# Altium schematic sheet Sheet1.SchDoc
size A3
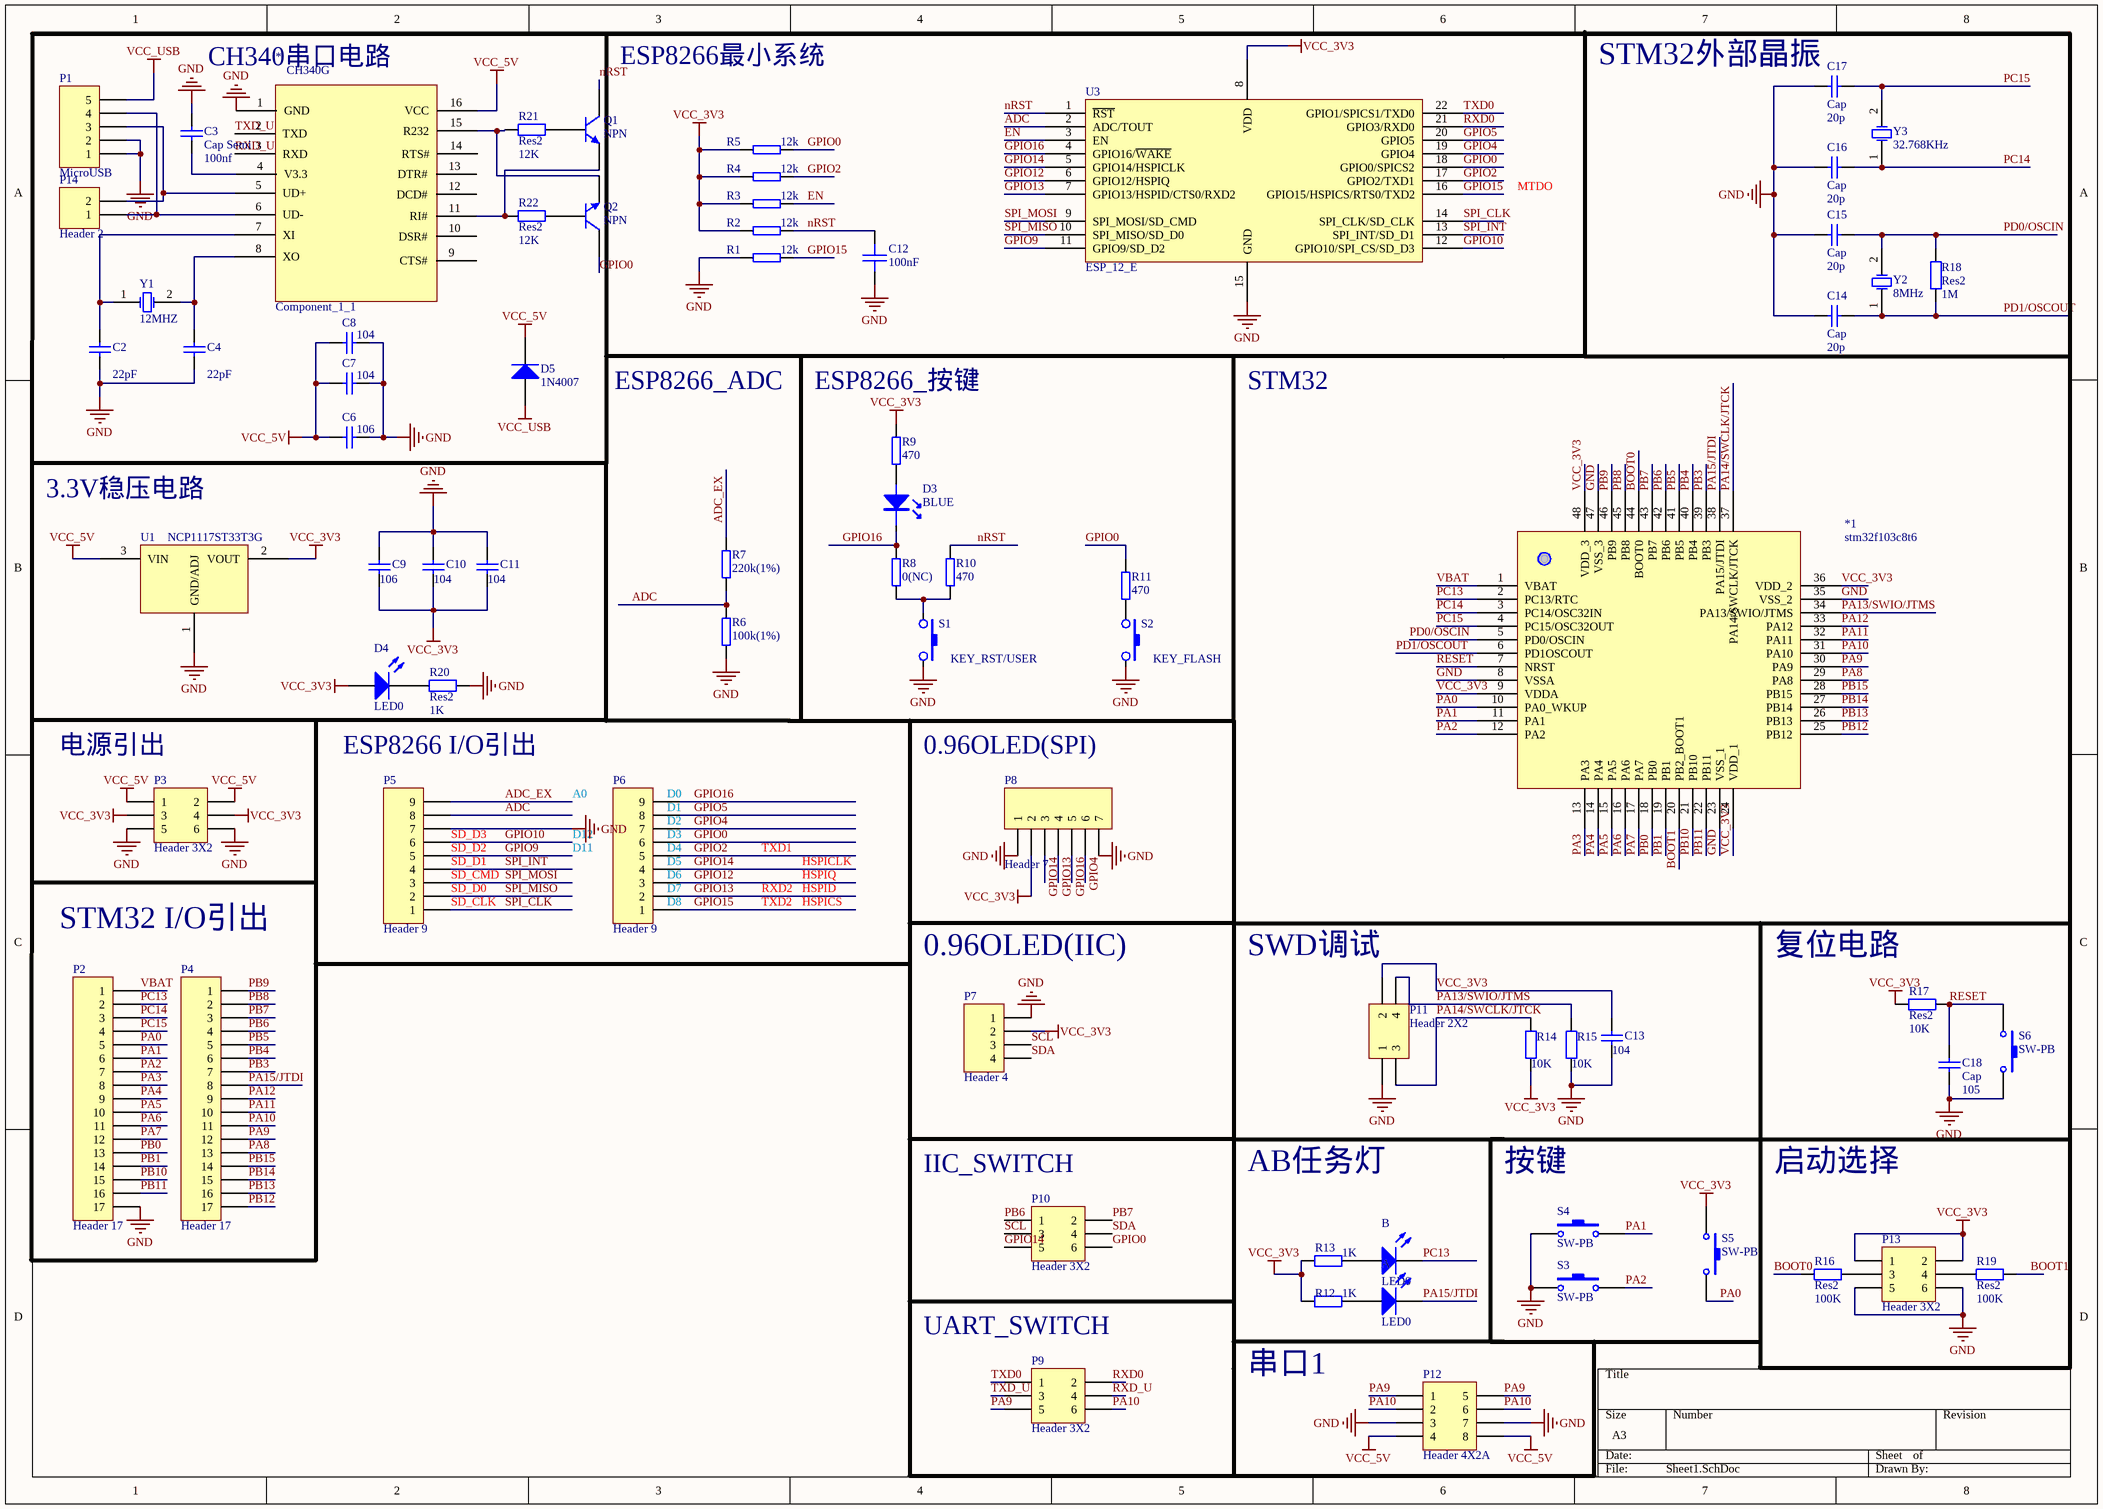
[diagram p0: Sheet1.SchDoc]

## Parts
*  Component_1_1
*1  stm32f103c8t6  [LQFP-48_M]
A  LED0  [2012[0805]]
B  LED0  [2012[0805]]
C2  value 22pF  [2012[0805]]  (hidden comment: Cap)
C3  Cap Semi  value 100nf  [2012[0805]]
C4  value 22pF  [2012[0805]]  (hidden comment: Cap)
C6  value 106  [C1206]  (hidden comment: Cap Semi)
C7  value 104  [2012[0805]]  (hidden comment: Cap Semi)
C8  value 104  [2012[0805]]  (hidden comment: Cap Semi)
C9  value 106  [C1206]  (hidden comment: Cap Semi)
C10  value 104  [2012[0805]]  (hidden comment: Cap Semi)
C11  value 104  [2012[0805]]  (hidden comment: Cap Semi)
C12  100nF  [2012[0805]]
C13  value 104  [2012[0805]]  (hidden comment: Cap)
C14  Cap  value 20p  [2012[0805]]
C15  Cap  value 20p  [2012[0805]]
C16  Cap  value 20p  [2012[0805]]
C17  Cap  value 20p  [2012[0805]]
C18  Cap  value 105  [2012[0805]]
D3  BLUE  [2012[0805]]
D4  LED0  [2012[0805]]
D5  1N4007  [2012[0805]]
P1  MicroUSB  [Micro_USB]
P2  Header 17  [HDR1X17]
P3  Header 3X2  [HDR2X3]
P4  Header 17  [HDR1X17]
P5  Header 9  [HDR1X9]
P6  Header 9  [HDR1X9]
P7  Header 4  [HDR1X4]
P8  Header 7  [HDR1X7]
P9  Header 3X2  [HDR2X3]
P10  Header 3X2  [HDR2X3]
P11  Header 2X2  [HDR2X2]
P12  Header 4X2A  [HDR2X4_CEN]
P13  Header 3X2  [HDR2X3]
P14  Header 2  [HDR1X2]
Q1  NPN  [SC70-LB3_L]
Q2  NPN  [SC70-LB3_L]
R1  12k  [2012[0805]]
R2  12k  [2012[0805]]
R3  12k  [2012[0805]]
R4  12k  [2012[0805]]
R5  12k  [2012[0805]]
R6  100k(1%)  [2012[0805]]
R7  220k(1%)  [2012[0805]]
R8  0(NC)  [2012[0805]]
R9  470  [2012[0805]]
R10  470  [2012[0805]]
R11  470  [2012[0805]]
R12  value 1K  [2012[0805]]  (hidden comment: Res2)
R13  value 1K  [2012[0805]]  (hidden comment: Res2)
R14  value 10K  [2012[0805]]  (hidden comment: Res2)
R15  value 10K  [2012[0805]]  (hidden comment: Res2)
R16  Res2  value 100K  [2012[0805]]
R17  Res2  value 10K  [2012[0805]]
R18  Res2  value 1M  [2012[0805]]
R19  Res2  value 100K  [2012[0805]]
R20  Res2  value 1K  [2012[0805]]
R21  Res2  value 12K  [2012[0805]]
R22  Res2  value 12K  [2012[0805]]
S1  KEY_RST/USER  [KEY]
S2  KEY_FLASH  [KEY]
S3  SW-PB  [KEY]
S4  SW-PB  [KEY]
S5  SW-PB  [KEY]
S6  SW-PB  [KEY]
U1  NCP1117ST33T3G  [SOT-223]
U3  ESP_12_E  [ESP_12F]
Y1  12MHZ  [XTAL-HCM49]
Y2  8MHz  [XTAL-HCM49]
Y3  32.768KHz  [XTAL32-2]

## Nets
GND: *.1(GND) *1.8(VSSA) *1.23(VSS_1) *1.35(VSS_2) *1.47(VSS_3) C2.1 C3.2 C4.1 C6.1 C7.1 C8.1 C9.2 C10.2 C11.2 C12.2 C13.1 C14.1 C15.1 C16.1 C17.1 C18.1 P1.1 P1.2 P2.17 P3.5 P3.6 P5.7 P7.1 P8.1 P8.7 P11.1 P12.3 P12.7 P13.5 P13.6 R1.1 R6.1 R15.1 R20.2 S1.2 S2.2 S3.1 S4.1 S6.2 U1.1(GND/ADJ) U3.15(GND)
VCC_3V3: *1.9(VDDA) *1.24(VDD_1) *1.36(VDD_2) *1.48(VDD_3) C9.1 C10.1 C11.1 C13.2 D4.1(A) P3.3 P3.4 P7.2 P8.2 P11.2 P13.1 P13.2 R2.1 R3.1 R4.1 R5.1 R9.2 R12.1 R13.1 R14.1 R17.1 S5.1 U1.2(VOUT) U3.8(VDD)
VCC_5V: *.16(VCC) C6.2 C7.2 C8.2 D5.2(K) P3.1 P3.2 P12.4 P12.8 U1.3(VIN)
VCC_USB: D5.1(A) P1.5
ADC: P5.8 R6.2 R7.1 U3.2(ADC/TOUT)
ADC_EX: P5.9 R7.2
BOOT0: *1.44(BOOT0) R16.1
BOOT1: *1.20(PB2_BOOT1) R19.2
EN: R3.2 U3.3(EN)
GPIO0: P6.6 P10.6 Q2.1(C) R5.2 R11.2 U3.18(GPIO0/SPICS2)
GPIO2: P6.5 R4.2 U3.17(GPIO2/TXD1)
GPIO4: P6.7 P8.6 U3.19(GPIO4)
GPIO5: P6.8 U3.20(GPIO5)
GPIO9: P5.5 U3.11(GPIO9/SD_D2)
GPIO10: P5.6 U3.12(GPIO10/SPI_CS/SD_D3)
GPIO12: P6.3 U3.6(GPIO12/HSPIQ)
GPIO13: P6.2 P8.4 U3.7(GPIO13/HSPID/CTS0/RXD2)
GPIO14: P6.4 P8.3 P10.5 U3.5(GPIO14/HSPICLK)
GPIO15: P6.1 R1.2 U3.16(GPIO15/HSPICS/RTS0/TXD2)
GPIO16: D3.2(K) P6.9 P8.5 R8.2 U3.4(GPIO16/~{WAKE})
nRST: C12.1 Q1.1(C) R2.2 R10.2 U3.1(~{RST})
PA0: *1.10(PA0_WKUP) P2.5 S5.2
PA1: *1.11(PA1) P2.6 S4.2
PA2: *1.12(PA2) P2.7 S3.2
PA3: *1.13(PA3) P2.8
PA4: *1.14(PA4) P2.9
PA5: *1.15(PA5) P2.10
PA6: *1.16(PA6) P2.11
PA7: *1.17(PA7) P2.12
PA8: *1.29(PA8) P4.13
PA9: *1.30(PA9) P4.12 P9.5 P12.1 P12.5
PA10: *1.31(PA10) P4.11 P9.6 P12.2 P12.6
PA11: *1.32(PA11) P4.10
PA12: *1.33(PA12) P4.9
PA13/SWIO/JTMS: *1.34(PA13/SWIO/JTMS) P11.4 R15.2
PA14/SWCLK/JTCK: *1.37(PA14/SWCLK/JTCK) P11.3 R14.2
PA15/JTDI: *1.38(PA15/JTDI) A.2(K) P4.8
PB0: *1.18(PB0) P2.13
PB1: *1.19(PB1) P2.14
PB3: *1.39(PB3) P4.7
PB4: *1.40(PB4) P4.6
PB5: *1.41(PB5) P4.5
PB6: *1.42(PB6) P4.4 P10.1
PB7: *1.43(PB7) P4.3 P10.2
PB8: *1.45(PB8) P4.2
PB9: *1.46(PB9) P4.1
PB10: *1.21(PB10) P2.15
PB11: *1.22(PB11) P2.16
PB12: *1.25(PB12) P4.17
PB13: *1.26(PB13) P4.16
PB14: *1.27(PB14) P4.15
PB15: *1.28(PB15) P4.14
PC13: *1.2(PC13/RTC) B.2(K) P2.2
PC14: *1.3(PC14/OSC32IN) C16.2 P2.3 Y3.1(OSC1)
PC15: *1.4(PC15/OSC32OUT) C17.2 P2.4 Y3.2(OSC2)
PD0/OSCIN: *1.5(PD0/OSCIN) C15.2 R18.2 Y2.2(OSC2)
PD1/OSCOUT: *1.6(PD1OSCOUT) C14.2 R18.1 Y2.1(OSC1)
RESET: *1.7(NRST) C18.2 R17.2 S6.1
RXD0: P9.2 U3.21(GPIO3/RXD0)
RXD_U: *.3(RXD) P9.4
SCL: P7.3 P10.3
SDA: P7.4 P10.4
SPI_CLK: P5.1 U3.14(SPI_CLK/SD_CLK)
SPI_INT: P5.4 U3.13(SPI_INT/SD_D1)
SPI_MISO: P5.2 U3.10(SPI_MISO/SD_D0)
SPI_MOSI: P5.3 U3.9(SPI_MOSI/SD_CMD)
TXD0: P9.1 U3.22(GPIO1/SPICS1/TXD0)
TXD_U: *.2(TXD) P9.3
VBAT: *1.1(VBAT) P2.1
Net*_4: *.4(V3.3) C3.1
Net*_5: *.5(UD+) P1.3 P14.2
Net*_6: *.6(UD-) P1.4 P14.1
Net*_7: *.7(XI) C2.2 Y1.1(OSC1)
Net*_8: *.8(XO) C4.2 Y1.2(OSC2)
Net*_11: *.11(RI#) Q1.3(E) R22.1
Net*_15: *.15(R232) Q2.3(E) R21.1
NetA_1: A.1(A) R12.2
NetB_1: B.1(A) R13.2
NetD3_1: D3.1(A) R9.1
NetD4_2: D4.2(K) R20.1
NetP13_3: P13.3 R16.2
NetP13_4: P13.4 R19.1
NetQ1_2: Q1.2(B) R21.2
NetQ2_2: Q2.2(B) R22.2
NetR8_1: R8.1 R10.1 S1.1
NetR11_1: R11.1 S2.1

Not connected (* = marked no-connect by the designer): * 9(CTS#) 10(DSR#) 12(DCD#) 13(DTR#) 14(RTS#)

## Notes on the sheet
- CH340串口电路
- (near Q1) ESP8266最小系统
- STM32外部晶振
- MTDO
- ESP8266_ADC
- (near R9) ESP8266_按键
- STM32
- 3.3V稳压电路
- 电源引出
- ESP8266 I/O引出
- 0.96OLED(SPI)
- (near P5) SD_D3
- (near P5) SD_D2
- A0
- D12
- D11
- (near P6) D0
- (near P6) D1
- (near P6) D2
- (near P6) D3
- (near P6) D4
- TXD1
- (near P5) SD_CLK
- (near P5) SD_D0
- (near P5) SD_CMD
- (near P5) SD_D1
- (near P6) D5
- (near P6) D6
- (near P6) D7
- (near P6) D8
- TXD2
- RXD2
- HSPICLK
- HSPIQ
- HSPID
- HSPICS
- STM32 I/O引出
- 0.96OLED(IIC)
- SWD调试
- 复位电路
- (near P10) IIC_SWITCH
- AB任务灯
- 按键
- 启动选择
- UART_SWITCH
- (near R12) 串口1
- (in symbol Component_1_1) CH340G

## Library data of the parts
A B D4 = LED0: Typical INFRARED GaAs LED; Published: 8-Jun-2000; LatestRevisionDate: 08-Jul-2005; LatestRevisionNote: Mech Layer 1 removed.; PackageReference: LED-0; Publisher: Altium Limited
  D4: PackageDescription: LED; 2 Leads
C2 C4 C13-C18 = Cap: Capacitor; Published: 8-Jun-2000; LatestRevisionDate: 17-Jul-2002; LatestRevisionNote: Re-released for DXP Platform.; PackageReference: RAD-0.3; Publisher: Altium Limited
  C2 C4: PackageDescription: Radial Cap, Thru-Hole; 2 Leads; 0.3 in Pin Spacing
C3 C6-C11 = Cap Semi: Capacitor (Semiconductor SIM Model); Published: 8-Jun-2000; LatestRevisionDate: 29-May-2009; LatestRevisionNote: IPC-7351 Footprint Added.; PackageReference: C1206; Publisher: Altium Limited; PackageDescription: Chip Capacitor
C12 = SMT_C_0402: Surface mount capacitor 0402
D3 = SMT_LED_0603: SMT LED
D5 = 1N4007: 1.0 Ampere General Purpose Rectifier; Published: 8-Jun-2000; LatestRevisionDate: 17-Jul-2002; LatestRevisionNote: Re-released for DXP Platform.; DatasheetDocument: 1998; PackageDocument: Aug-1999; PackageReference: DO-41; Publisher: Altium Limited; Code_JEDEC: DO-204-AL; ComponentLink1Description: Manufacturer Link; ComponentLink1URL: http://www.fairchildsemi.com/; ComponentLink2Description: Pinout Specification; ComponentLink2URL: http://www.fairchildsemi.com/ds/1N%2F1N4001.pdf
P1 = Header 5: Header, 5-Pin; LatestRevisionDate: 17-Jul-2002; LatestRevisionNote: Re-released for DXP Platform.; Publisher: Altium Limited
P2 P4 = Header 17: Header, 17-Pin; LatestRevisionDate: 17-Jul-2002; LatestRevisionNote: Re-released for DXP Platform.; Publisher: Altium Limited
P3 P9 P10 P13 = Header 3X2: Header, 3-Pin, Dual row; LatestRevisionDate: 17-Jul-2002; LatestRevisionNote: Re-released for DXP Platform.; Publisher: Altium Limited
P5 P6 = Header 9: Header, 9-Pin; LatestRevisionDate: 17-Jul-2002; LatestRevisionNote: Re-released for DXP Platform.; Publisher: Altium Limited
P7 = Header 4: Header, 4-Pin; LatestRevisionDate: 17-Jul-2002; LatestRevisionNote: Re-released for DXP Platform.; Publisher: Altium Limited
P8 = Header 7: Header, 7-Pin; LatestRevisionDate: 17-Jul-2002; LatestRevisionNote: Re-released for DXP Platform.; Publisher: Altium Limited
P11 = Header 2X2: Header, 2-Pin, Dual row; LatestRevisionDate: 17-Jul-2002; LatestRevisionNote: Re-released for DXP Platform.; Publisher: Altium Limited
P12 = Header 4X2A: Header, 4-Pin, Dual row; LatestRevisionDate: 17-Jul-2002; LatestRevisionNote: Re-released for DXP Platform.; Publisher: Altium Limited
P14 = Header 2: Header, 2-Pin; LatestRevisionDate: 17-Jul-2002; LatestRevisionNote: Re-released for DXP Platform.; Publisher: Altium Limited
Q1 Q2 = NPN: NPN Bipolar Transistor; Published: 8-Jun-2000; LatestRevisionDate: 17-Jul-2002; LatestRevisionNote: Re-released for DXP Platform.; PackageReference: TO-226-AA; Publisher: Altium Limited; PackageDescription: TO, Flat Index; 3 In-Line, Axial Leads; Body Dia. 4.8mm; Leads 0.55 x 0.51 mm (max); Code_JEDEC: TO-226-AA
R1-R11 = SMT_R_0402: Surface mount resistor 0402
R12-R22 = Res2: Resistor; Published: 8-Jun-2000; LatestRevisionDate: 17-Jul-2002; LatestRevisionNote: Re-released for DXP Platform.; PackageReference: AXIAL-0.4; Publisher: Altium Limited
  R20-R22: PackageDescription: Axial Device, Thru-Hole; 2 Leads; 0.4 in Pin Spacing
S1 S2 = SMT_SW_PTS_820: SMT Tactile ?Switch PTS 820 Series
S3-S6 = SW-PB: Switch; Published: 24-Mar-1999; LatestRevisionDate: 17-Jul-2002; LatestRevisionNote: Re-released for DXP Platform.; PackageReference: SPST-2; Publisher: Altium Limited
U1 = NCP1117: NCP1117, NCV1117. 1.0 A Low-Dropout Positive  Fixed and Adjustable  Voltage Regulators
U3 = ESP_12_E: ESP-12 Wi-Fi Module by AI-Thinker; IC: ESP8266-EX; Vendor: Ai-thinker
Y1-Y3 = XTAL: Crystal Oscillator; Published: 8-Jun-2000; LatestRevisionDate: 17-Jul-2002; LatestRevisionNote: Re-released for DXP Platform.; PackageReference: R38; Publisher: Altium Limited
  Y1: PackageDescription: Crystal, Thru-Hole; 2 Leads; Body 3.1 x 8.2 mm (Dia.xH)